# EAGLE design SensorInterface (EAGLE 9.2.1)

## Sheet 1 of 2
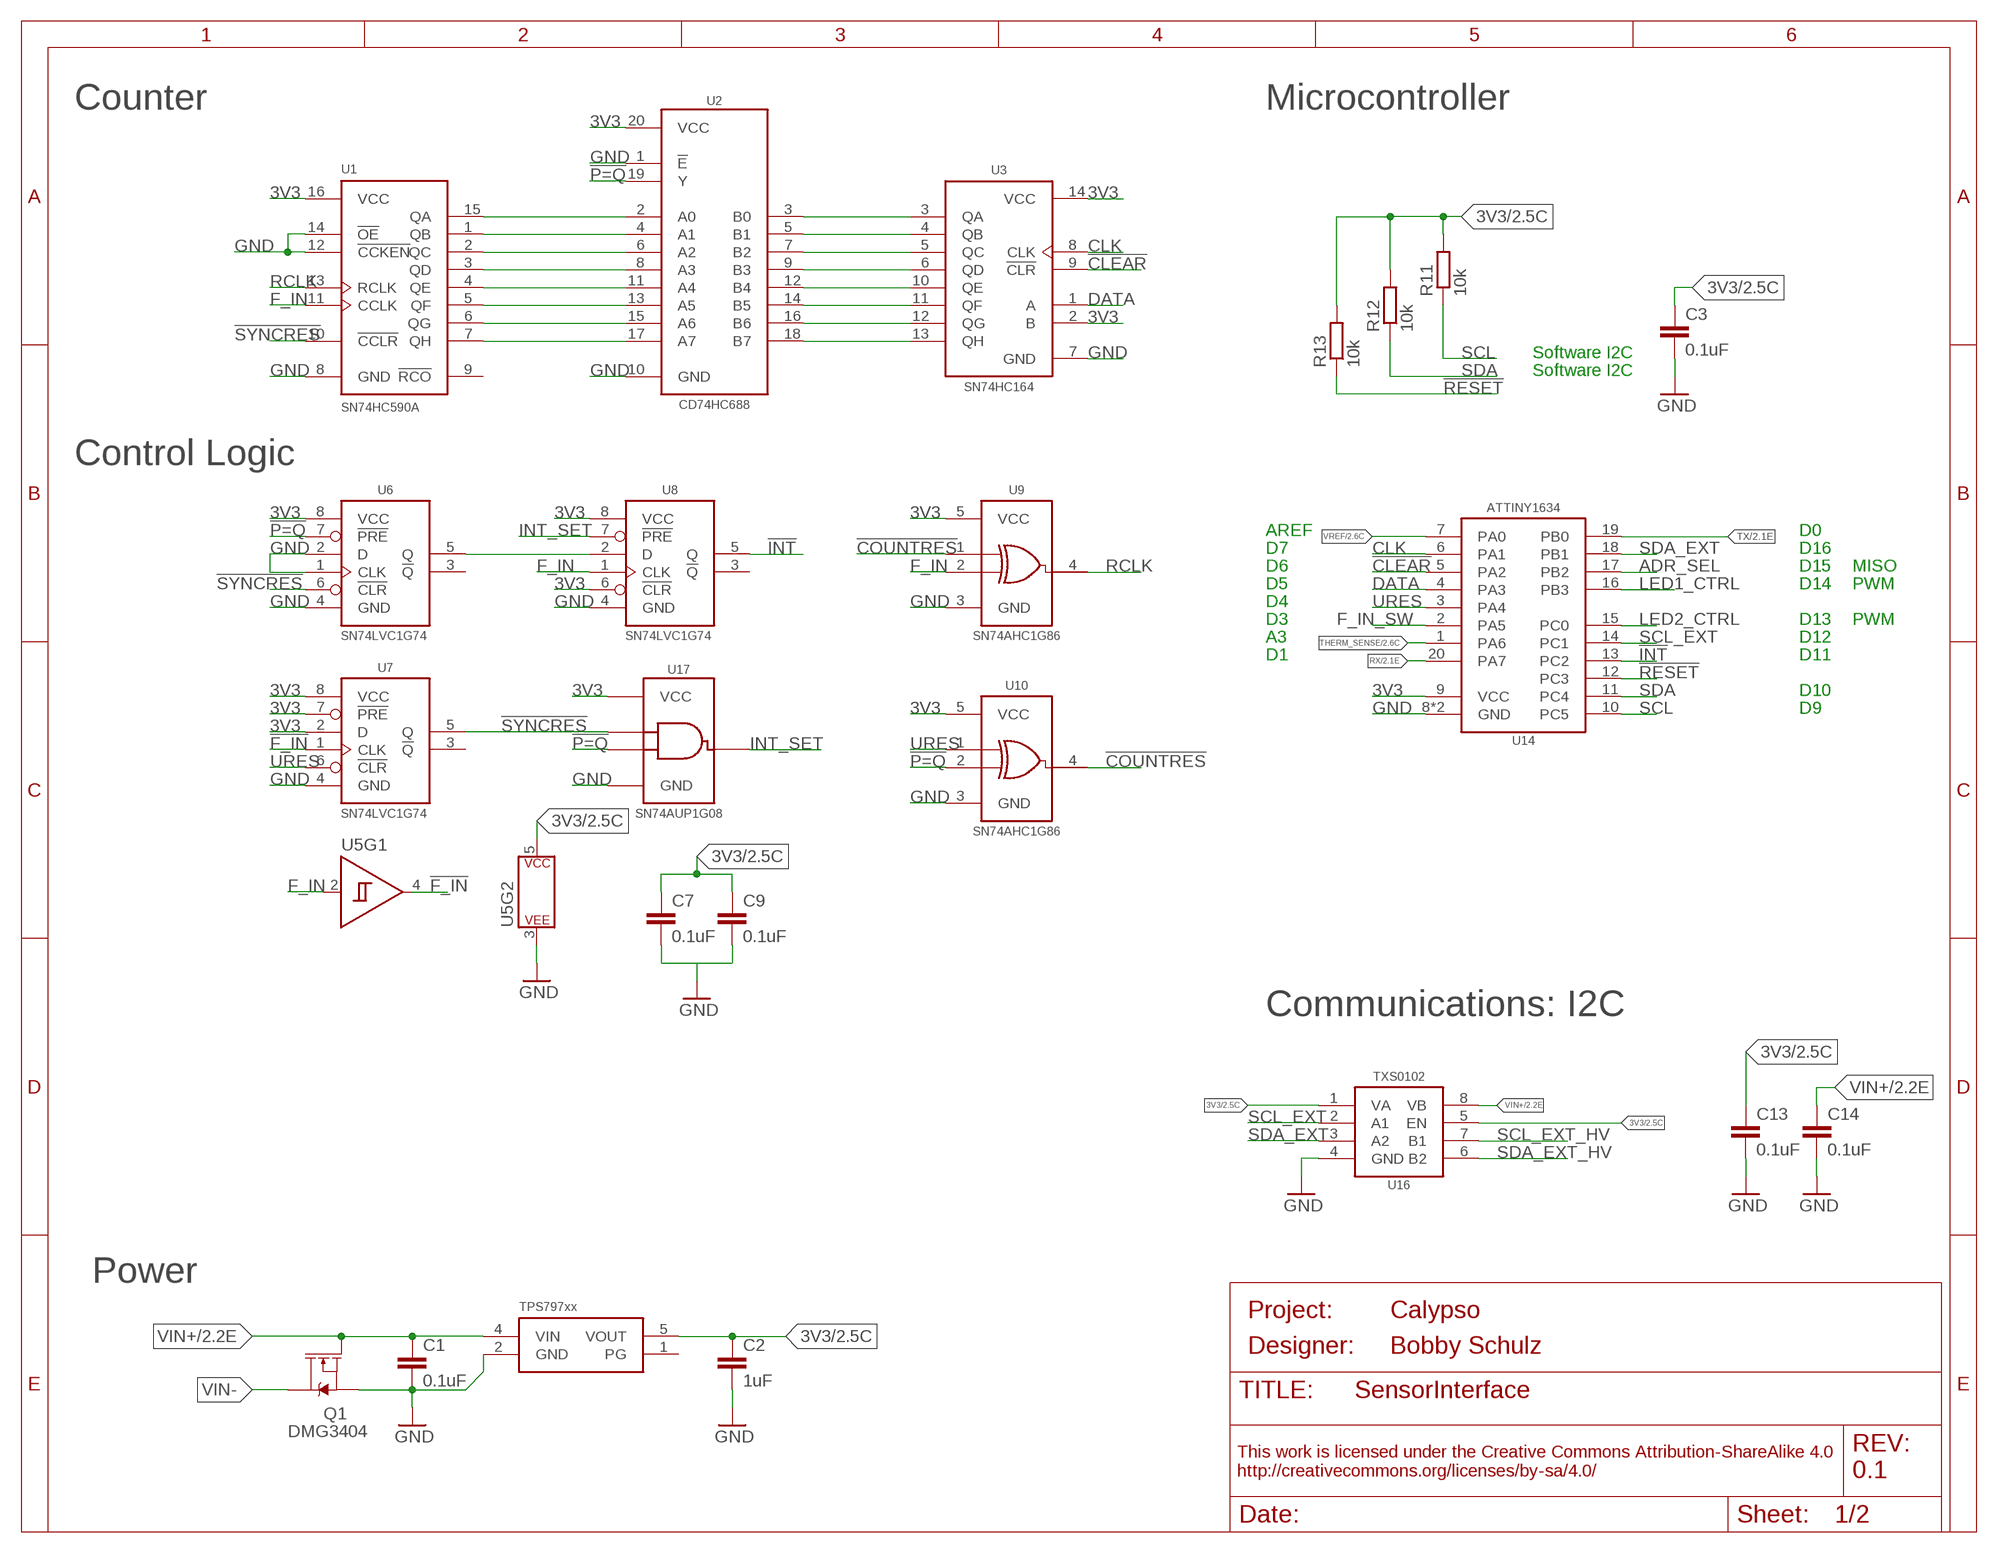
[diagram p0: schematic, sheet 1]
FRAME1 (FRAME_A_L): DESIGNER: Bobby Schulz; PROJECT: Calypso; REV: 0.1

### Parts
C1  0.1uF  C-EU0.1UFC0603  [C0603]
C2  1uF  C-EU1UFC0603  [C0603]
C3  0.1uF  C-EU0.1UFC0402  [C0402]
C7  0.1uF  C-EUC0603  [C0603]
C9  0.1uF  C-EUC0603  [C0603]
C13  0.1uF  C-EU0.1UFC0402  [C0402]
C14  0.1uF  C-EU0.1UFC0402  [C0402]
Q1  DMG3404  MOSFET-NCH-DMG3404L  [SOT23-3]
R11  10k  R-EU_10KR0402  [R0402]
R12  10k  R-EU_10KR0402  [R0402]
R13  10k  R-EU_10KR0402  [R0402]
U1  SN74HC590AD  [SO16]
U2  CD74HCT688DW  [SO-20DW]
U3  SN74HC164D  [SO14]
U5  SN74LVC1G14DCK  [DCK_R-PDSO-G5]
U6  SN74LVC1G74DCU  [DCU_(R-PDSO-G8)]
U7  SN74LVC1G74DCU  [DCU_(R-PDSO-G8)]
U8  SN74LVC1G74DCU  [DCU_(R-PDSO-G8)]
U9  SN74AHC1G86DCK  [DCK_R-PDSO-G5]
U10  SN74AHC1G86DCK  [DCK_R-PDSO-G5]
U14  ATTINY1634QFN  [QFN20]
U16  TXS0102DQM  [DQM_R-PX2SON-N8]
U17  SN74AUP1G08DCK  [DCK_R-PDSO-G5]
U$1  TPS79733  [DCK_R-PDSO-G5]

### Nets
3V3: C2.1 C3.1 C7.1 C9.1 C13.1 R11.2 R12.2 R13.2 U1.16(VCC) U2.20(VCC) U3.2(B) U3.14(VCC) U5.5(P$V+) U6.8(VCC) U7.2(D) U7.7(!PRE) U7.8(VCC) U8.6(!CLR) U8.8(VCC) U9.5(VCC) U10.5(VCC) U14.9(VCC) U16.1(VA) U16.5(EN) U17.5(VCC) U$1.5(VOUT) ; also sheet 2
!CLEAR: U3.9(!CLR) U14.5(PA2)
!COUNTRES: U9.1(A) U10.4(Y)
!F_IN: U5.4(Y) U7.1(CLK)
!INT: U8.5(Q) U14.13(PC2) ; also sheet 2
!P=Q: U2.19(Y) U6.7(!PRE) U10.2(B) U17.2(B)
!RESET: R13.1 U14.12(PC3) ; also sheet 2
!SYNCRES: U1.10(!CCLR) U6.6(!CLR) U7.5(Q) U17.1(A)
ADR_SEL: U14.17(PB2) ; also sheet 2
CLK: U3.8(CLK) U14.6(PA1)
DATA: U3.1(A) U14.4(PA3)
F_IN: U1.11(CCLK) U5.2(A) U8.1(CLK) U9.2(B) ; also sheet 2
F_IN_SW: U14.2(PA5) ; also sheet 2
GND: C1.2 C2.2 C3.2 C7.2 C9.2 C13.2 C14.2 Q1.2(S) U1.8(GND) U1.12(!CCKEN) U1.14(!OE) U2.1(!E) U2.10(GND) U3.7(GND) U5.3(P$V-) U6.1(CLK) U6.2(D) U6.4(GND) U7.4(GND) U8.4(GND) U9.3(GND) U10.3(GND) U14.8(GND) U14.EP(GND) U16.4(GND) U17.3(GND) U$1.2(GND) ; also sheet 2
INT_SET: U8.7(!PRE) U17.4(Y)
LED1_CTRL: U14.16(PB3) ; also sheet 2
LED2_CTRL: U14.15(PC0) ; also sheet 2
N$1: U1.15(QA) U2.2(A0)
N$2: U1.1(QB) U2.4(A1)
N$3: U1.2(QC) U2.6(A2)
N$4: U1.3(QD) U2.8(A3)
N$5: U1.4(QE) U2.11(A4)
N$6: U1.5(QF) U2.13(A5)
N$7: U1.6(QG) U2.15(A6)
N$8: U1.7(QH) U2.17(A7)
N$9: U2.3(B0) U3.3(QA)
N$10: U2.5(B1) U3.4(QB)
N$11: U2.7(B2) U3.5(QC)
N$12: U2.9(B3) U3.6(QD)
N$13: U2.12(B4) U3.10(QE)
N$14: U2.14(B5) U3.11(QF)
N$15: U2.16(B6) U3.12(QG)
N$16: U2.18(B7) U3.13(QH)
N$20: U6.5(Q) U8.2(D)
RCLK: U1.13(RCLK) U9.4(Y)
RX: U14.20(PA7) ; also sheet 2
SCL: R11.1 U14.10(PC5) ; also sheet 2
SCL_EXT: U14.14(PC1) U16.2(A1) ; also sheet 2
SCL_EXT_HV: U16.7(B1) ; also sheet 2
SDA: R12.1 U14.11(PC4) ; also sheet 2
SDA_EXT: U14.18(PB1) U16.3(A2) ; also sheet 2
SDA_EXT_HV: U16.6(B2) ; also sheet 2
THERM_SENSE: U14.1(PA6) ; also sheet 2
TX: U14.19(PB0) ; also sheet 2
URES: U7.6(!CLR) U10.1(A) U14.3(PA4) ; also sheet 2
VIN+: C1.1 C14.1 Q1.1(G) U16.8(VB) U$1.4(VIN) ; also sheet 2
VIN-: Q1.3(D) ; also sheet 2
VREF: U14.7(PA0) ; also sheet 2
Unconnected: U1.9(!RCO) U6.3(!Q) U7.3(!Q) U8.3(!Q) U$1.1(PG)

### Notes on the sheet
- Counter | Microcontroller
- Software I2C
- Software I2C
- Control Logic
- AREF | D0
- D7 | D16
- D6 | D15 | MISO
- D5 | D14 | PWM
- D4
- D3 | D13 | PWM
- A3 | D12
- D1 | D11
- D10
- D9
- Communications: I2C
- Power

## Sheet 2 of 2
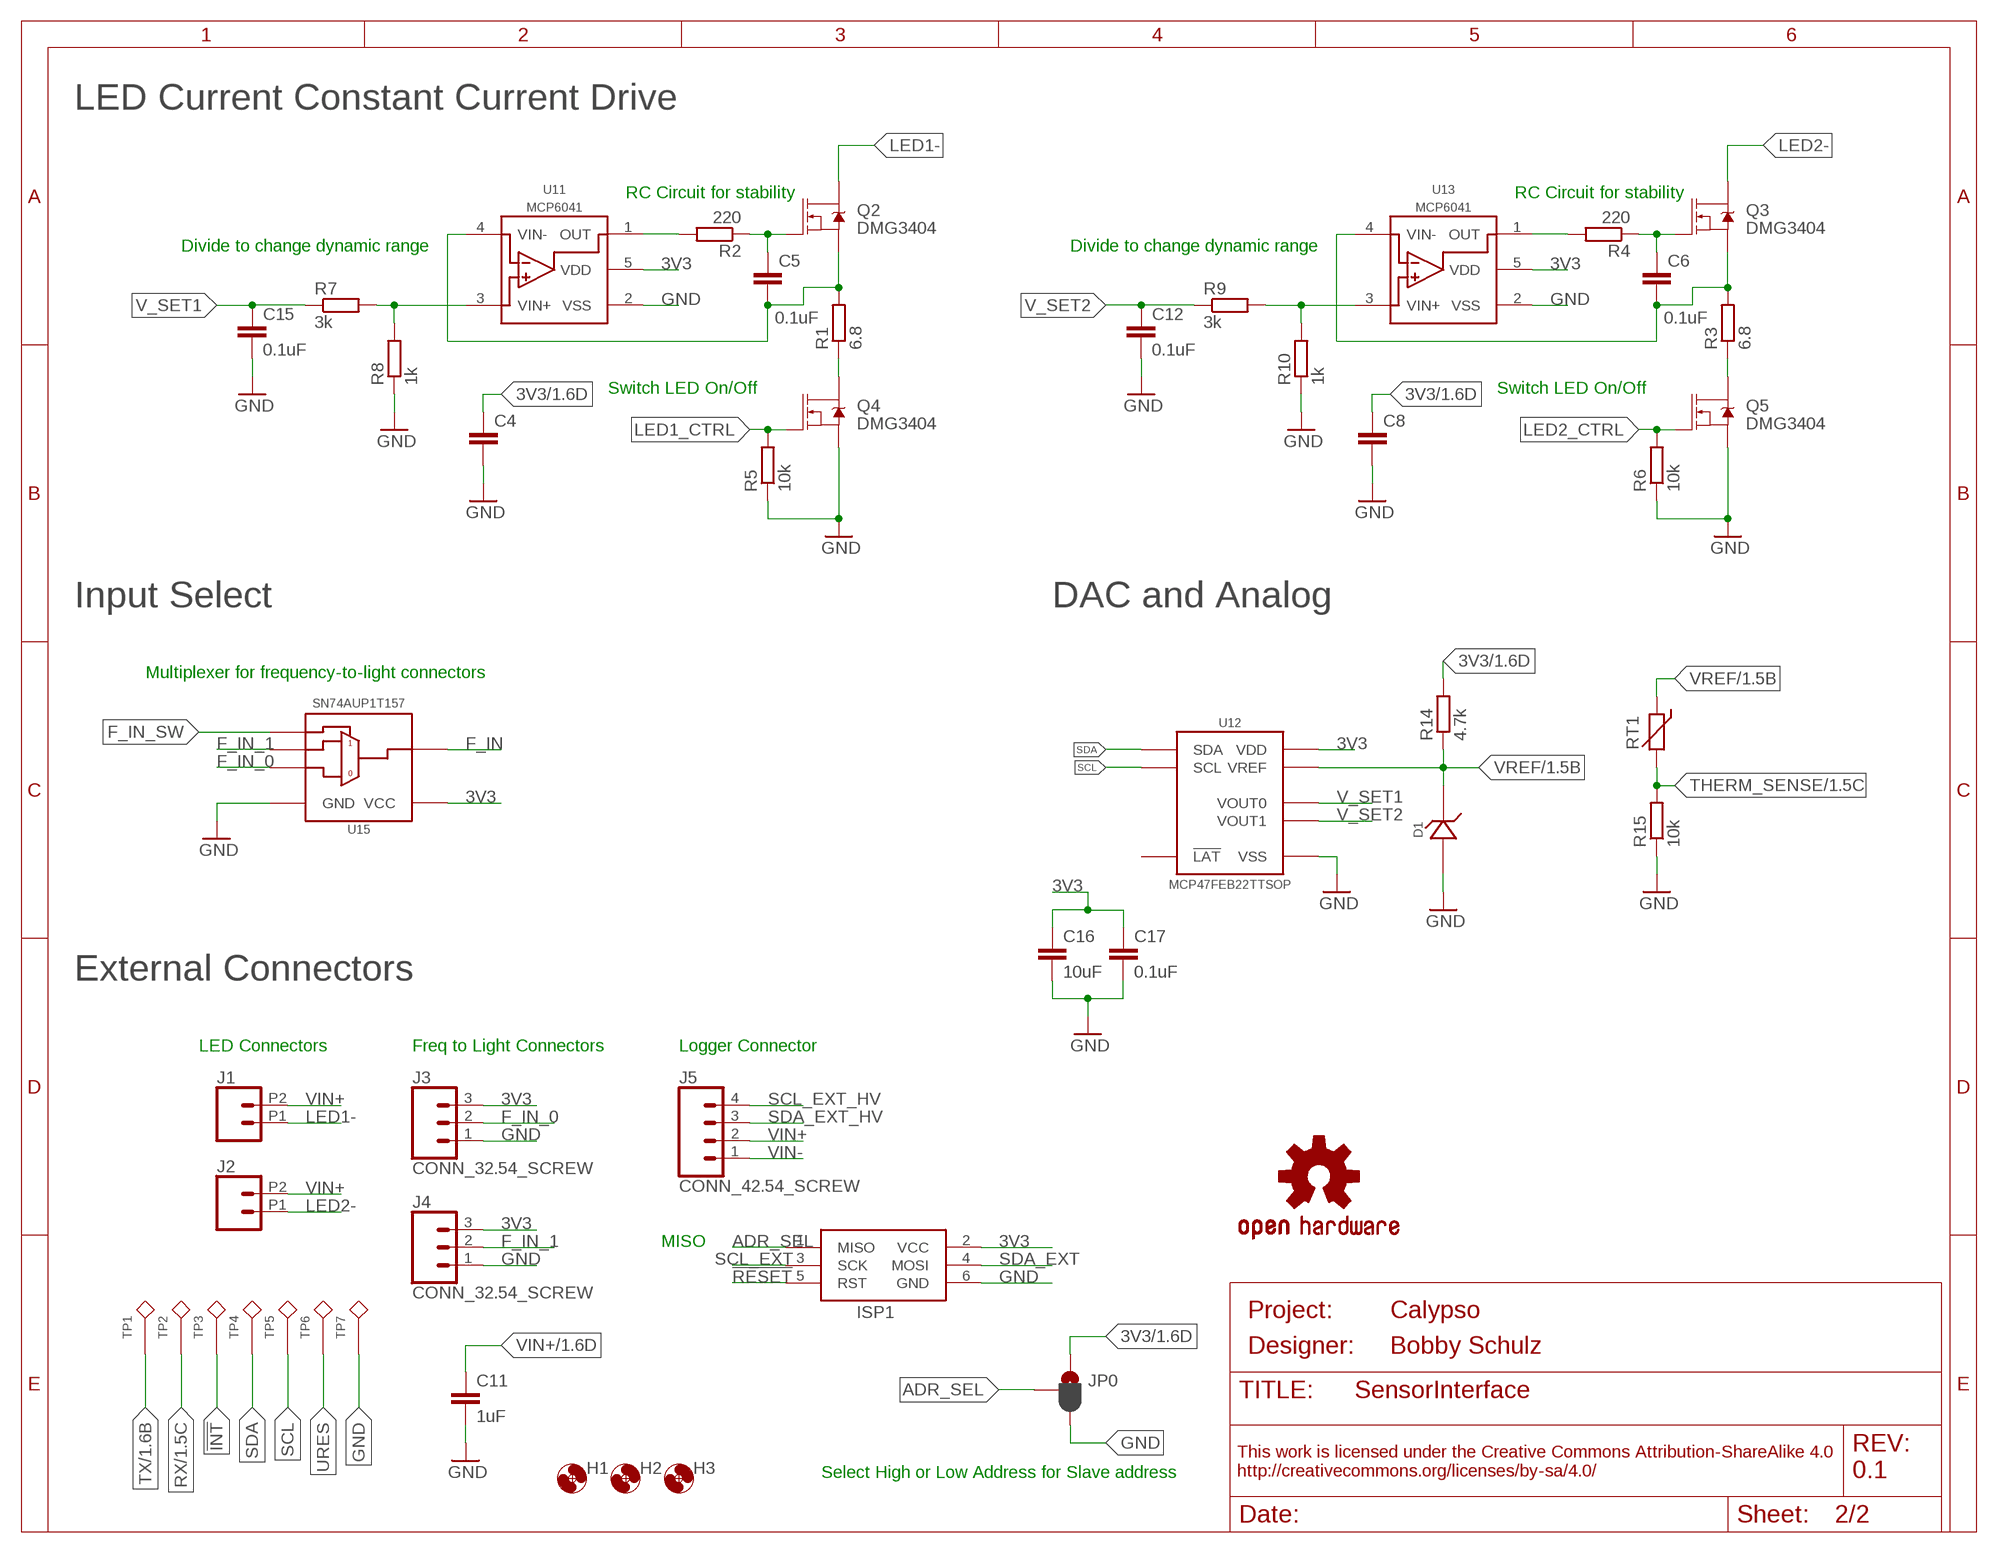
[diagram p1: schematic, sheet 2]
FRAME2 (FRAME_A_L): DESIGNER: Bobby Schulz; PROJECT: Calypso; REV: 0.1

### Parts
C4  C-EU0.1UFC0402  [C0402]
C5  0.1uF  C-EUC0603  [C0603]
C6  0.1uF  C-EUC0603  [C0603]
C8  C-EU0.1UFC0402  [C0402]
C11  1uF  C-EUC0603  [C0603]
C12  0.1uF  C-EU0.1UFC0603  [C0603]
C15  0.1uF  C-EU0.1UFC0603  [C0603]
C16  10uF  C-EUC0805  [C0805]
C17  0.1uF  C-EUC0603  [C0603]
D1  LM40402.048  [SOT23-3]
H1  MOUNTING_HOLE2_NP  [2_56]
H2  MOUNTING_HOLE2_NP  [2_56]
H3  MOUNTING_HOLE2_NP  [2_56]
ISP1  AVRISP-6  [AVRISP]
J1  CONN_02SCREW_2.54  [1X02_2.54_SCREWTERM]
J2  CONN_02SCREW_2.54  [1X02_2.54_SCREWTERM]
J3  CONN_32.54_SCREW  [1X03_SCREW]
J4  CONN_32.54_SCREW  [1X03_SCREW]
J5  CONN_42.54_SCREW  [1X04_SCREW]
JP0  JUMPER-SMT_3_1-NC_PASTE_SILK  [SMT-JUMPER_3_1-NC_PASTE_SILK]
LOGO1  OSHW-LOGOM  [OSHW-LOGO-M]
Q2  DMG3404  MOSFET-NCH-DMG3404L  [SOT23-3]
Q3  DMG3404  MOSFET-NCH-DMG3404L  [SOT23-3]
Q4  DMG3404  MOSFET-NCH-DMG3404L  [SOT23-3]
Q5  DMG3404  MOSFET-NCH-DMG3404L  [SOT23-3]
R1  6.8  R-EU_R0603  [R0603]
R2  220  R-EU_R0603  [R0603]
R3  6.8  R-EU_R0603  [R0603]
R4  220  R-EU_R0603  [R0603]
R5  10k  R-EU_R0603  [R0603]
R6  10k  R-EU_R0603  [R0603]
R7  3k  R-EU_R0603  [R0603]
R8  1k  R-EU_R0603  [R0603]
R9  3k  R-EU_R0603  [R0603]
R10  1k  R-EU_R0603  [R0603]
R14  4.7k  R-EU_R0603  [R0603]
R15  10k  R-EU_P10KR0603  [R0603]
RT1  THERMISTOR10K  [R0603]
TP1  TESTPOINTRCU  [TESTPOINT_0603]
TP2  TESTPOINTRCU  [TESTPOINT_0603]
TP3  TESTPOINTRCU  [TESTPOINT_0603]
TP4  TESTPOINTRCU  [TESTPOINT_0603]
TP5  TESTPOINTRCU  [TESTPOINT_0603]
TP6  TESTPOINTRCU  [TESTPOINT_0603]
TP7  TESTPOINTRCU  [TESTPOINT_0603]
U11  MCP6041  [SOT23-5]
U12  MCP47FEB22TTSOP  [TTSOP_8]
U13  MCP6041  [SOT23-5]
U15  SN74AUP1T157DCK  [DCK_R-PDSO-G6]

### Nets
3V3: C4.1 C8.1 C16.1 C17.1 ISP1.2(VCC) J3.3 J4.3 JP0.1 R14.2 U11.5(VDD) U12.1(VDD) U13.5(VDD) U15.5(VCC) ; also sheet 1
!INT: TP3.1 ; also sheet 1
!RESET: ISP1.5(RST) ; also sheet 1
ADR_SEL: ISP1.1(MISO) JP0.2 ; also sheet 1
F_IN: U15.6(Y) ; also sheet 1
F_IN_0: J3.2 U15.3(B)
F_IN_1: J4.2 U15.1(A)
F_IN_SW: U15.4(C) ; also sheet 1
GND: C4.2 C8.2 C11.2 C12.2 C15.2 C16.2 C17.2 D1.2(A) ISP1.6(GND) J3.1 J4.1 JP0.3 Q4.2(S) Q5.2(S) R5.1 R6.1 R8.1 R10.1 R15.1 TP7.1 U11.2(VSS) U12.5(VSS) U13.2(VSS) U15.2(GND) ; also sheet 1
LED1-: J1.P1 Q2.3(D)
LED1_CTRL: Q4.1(G) R5.2 ; also sheet 1
LED2-: J2.P1 Q3.3(D)
LED2_CTRL: Q5.1(G) R6.2 ; also sheet 1
N$18: R7.2 R8.2 U11.3(VIN+)
N$19: C6.2 Q3.2(S) R3.2 U13.4(VIN-)
N$21: C6.1 Q3.1(G) R4.1
N$22: C5.2 Q2.2(S) R1.2 U11.4(VIN-)
N$23: C5.1 Q2.1(G) R2.1
N$24: R2.2 U11.1(OUT)
N$25: R4.2 U13.1(OUT)
N$26: Q5.3(D) R3.1
N$27: Q4.3(D) R1.1
N$29: R9.2 R10.2 U13.3(VIN+)
RX: TP2.1 ; also sheet 1
SCL: TP5.1 U12.7(SCL) ; also sheet 1
SCL_EXT: ISP1.3(SCK) ; also sheet 1
SCL_EXT_HV: J5.4 ; also sheet 1
SDA: TP4.1 U12.8(SDA) ; also sheet 1
SDA_EXT: ISP1.4(MOSI) ; also sheet 1
SDA_EXT_HV: J5.3 ; also sheet 1
THERM_SENSE: R15.2 RT1.2 ; also sheet 1
TX: TP1.1 ; also sheet 1
URES: TP6.1 ; also sheet 1
V_SET1: C15.1 R7.1 U12.3(VOUT0)
V_SET2: C12.1 R9.1 U12.4(VOUT1)
VIN+: C11.1 J1.P2 J2.P2 J5.2 ; also sheet 1
VIN-: J5.1 ; also sheet 1
VREF: D1.1(C) R14.1 RT1.1 U12.2(VREF) ; also sheet 1
Unconnected: U12.6(!LAT)

### Notes on the sheet
- LED Current Constant Current Drive
- RC Circuit for stability | RC Circuit for stability
- Divide to change dynamic range | Divide to change dynamic range
- Switch LED On/Off | Switch LED On/Off
- Input Select | DAC and Analog
- Multiplexer for frequency-to-light connectors
- External Connectors
- LED Connectors | Freq to Light Connectors | Logger Connector
- MISO
- Select High or Low Address for Slave address

## Library data of the parts
C1 C12 C15 = bschulz_passives:C-EU: CAPACITOR, European symbol; DIGIKEY: 490-6051-1-ND; MF: Murata; MPN: GCM188R71E104KA57D
C2 = bschulz_passives:C-EU: CAPACITOR, European symbol; DIGIKEY: 490-10479-1-ND; MF: Murata; MPN: GRM188R61C105KA12D
C3 C4 C8 C13 C14 = bschulz_passives:C-EU: CAPACITOR, European symbol; DIGIKEY: 490-4759-1-ND; MF: Murata; MPN: GCM155R71C104KA55D
C5-C7 C9 C11 C16 C17 = bschulz_passives:C-EU: CAPACITOR, European symbol
D1 = bschulz:LM4040: LM4040 - Precision Micropower Shunt Voltage Referance Characteristics: VReverseBreakdown: 1.225V, 2.5V, 4.096V, 5.0V Output Current: 15 mA Tolerance: 1% Temp Coeficient: ±15ppm/C° Operating Temperature: -40°C to 85°C Digikey: 576-1047-1-ND (Microchip, 2.5V) <https://www.digikey.com/product-detail/en/microchip-technology/LM4040DYM3-2.5-TR/576-1047-1-ND/771818> 576-1048-1-ND (Microchip, 4.096V) <https://www.digikey.com/product-detail/en/microchip-technology/LM4040DYM3-4.1-TR/576-1048-1-ND/771819> 5LM4040CIM3-2.0/NOPBCT-ND (TI, 2.048V) <https://www.digikey.com/product-detail/en/texas-instruments/LM4040CIM3-2.0-NOPB/LM4040CIM3-2.0-NOPBCT-ND/2350623>; DIGIKEY: LM4040CIM3-2.0/NOPBCT-ND; MF: TI; MPN: LM4040CIM3-2.0/NOPB
H1-H3 = bschulz:MOUNTING_HOLE: Genaric Mechanical Mounting Hole Hole diameter based on max body diameter + 15% Keepout ring is for diameter of socket cap screw (minimum required clearance) TPlace ring is for diameter of pan head screw (recomended clearance) Specifications: Socket Cap <http://fastener-express.com/fastener-technical/SocketscapSS-Alloy.pdf> Button Head Socket Cap <http://fastener-express.com/fastener-technical/Button-Socket-alloy.pdf> Pan Head <http://fastener-express.com/fastener-technical/pan-machine-Screws.pdf>
ISP1 = bschulz:AVRISP: AVR ISP HEADER Standard 6 pin header for AVR programming
J1 J2 = bschulz:CONN_02: Multi connection point. Often used as Generic Header-pin footprint for 0.1 inch spaced/style header connections On any of the 0.1 inch spaced packages, you can populate with these: Break Away Headers - Straight <https://www.sparkfun.com/products/116> (PRT-00116) Break Away Male Headers - Right Angle <https://www.sparkfun.com/products/553> (PRT-00553) Female Headers <https://www.sparkfun.com/products/115> (PRT-00115) Break Away Headers - Machine Pin <https://www.sparkfun.com/products/117> (PRT-00117) Break Away Female Headers - Swiss Machine Pin <https://www.sparkfun.com/products/743> (PRT-00743) For SCREWTERMINALS and SPRING TERMINALS visit here: Screw Terimnals on SparkFun.com <https://www.sparkfun.com/search/results?term=Screw+Terminals> (5mm/3.5mm/2.54mm spacing) This device is also useful as a general connection point to wire up your design to another part of your project. Our various solder wires solder well into these plated through hole pads. Hook-Up Wire - Assortment (Stranded, 22 AWG) <https://www.sparkfun.com/products/11375> (PRT-11375) Hook-Up Wire - Assortment (Solid Core, 22 AWG) <https://www.sparkfun.com/products/11367> (PRT-11367) View the entire wire category on our website here <https://www.sparkfun.com/categories/141> Special notes: Molex polarized connector foot print use with: PRT-08233 with associated crimp pins and housings. 2.54_SCREWTERM for use with PRT-10571. 3.5mm Screw Terminal footprints for PRT-08084 5mm Screw Terminal footprints for use with PRT-08432; DIGIKEY: ED10561-ND; MF: OnShore; MPN: OSTVN02A150
J3 J4 = bschulz:CONN_3: Genaric 3 pin connector
J5 = bschulz:CONN_4: Genaric 4 pin connector; DIGIKEY: ED10563-ND; MF: On Shore; MPN: OSTVN04A150
JP0 = SparkFun-Jumpers:JUMPER-SMT_3_1-NC_PASTE: Normally closed solder jumper (1 of 2 connections) This jumper has an aperture in the stencil to allow solder paste to bridge one of the two connections. One connection is normally closed (NC), while the other is normally open (NO). Wick off the solder to open the connection. Reapply solder to reclose the connection. Apply solder to the other side instead to change the current path.
LOGO1 = bschulz:OSHW-LOGO: Open-Source Hardware (OSHW) Logo This logo indicates the piece of hardware it is found on incorporates a OSHW license and/or adheres to the definition of open source hardware found here: http://freedomdefined.org/OSHW
Q1-Q5 = bschulz:MOSFET-NCH: N-channel MOSFETs Voltage controlled devices that allow control of high current outputs. SparkFun Products: SparkFun OpenScale <https://www.sparkfun.com/products/13261> SparkFun Digital Sandbox <https://www.sparkfun.com/products/12651> SparkFun Monster Moto Shield <https://www.sparkfun.com/products/10182> SparkFun MOSFET Power Controller <https://www.sparkfun.com/products/11214>; DIGIKEY: DMG3404L-7DICT-ND; MF: Diodes Incorporated; MPN: DMG3404L-7
R1-R10 R14 = bschulz_passives:R-EU_: RESISTOR, European symbol Digikey Parts: Yageo, 0402 <https://www.digikey.com/products/en/resistors/chip-resistor-surface-mount/52?k=&pkeyword=&sf=0&FV=ffec1104%2Cfffc000d%2C1c0002%2C440067%2C1f140000%2Cffe00034%2C400004&quantity=&ColumnSort=0&page=1&stock=1&pageSize=25> Yageo, 0603 <https://www.digikey.com/products/en/resistors/chip-resistor-surface-mount/52?k=&pkeyword=&s=4356&s=47360&sf=0&FV=fffc000d%2C1c0002%2C142c040c%2C1f140000%2Cffe00034&quantity=10&ColumnSort=1000011&page=1&stock=1&pageSize=25> Panasonic, 0603 <https://www.digikey.com/products/en/resistors/chip-resistor-surface-mount/52?k=&pkeyword=&pv252=68&sf=0&FV=ffec373d%2C1c0002%2C142c040c%2C1f140000%2Cffe00034%2C80002%2Cc0001&quantity=&ColumnSort=0&page=1&stock=1&pageSize=25> Panasonic, precision, 0603 <https://www.digikey.com/products/en/resistors/chip-resistor-surface-mount/52?FV=ffec4907%2Cfffc000a%2Cc0172%2C142c040c%2C1f140000%2Cffe00034%2C1c0002&quantity=100&ColumnSort=2085&page=1&stock=1&pageSize=25> Panasonic, 0805 <https://www.digikey.com/products/en/resistors/chip-resistor-surface-mount/52?k=&pkeyword=&pv3=1&sf=0&FV=ffec373d%2C1c0002%2C1f140000%2Cffe00034%2C142c040d&quantity=&ColumnSort=0&page=1&stock=1&pageSize=25> Rohm, current sense <https://www.digikey.com/products/en/resistors/chip-resistor-surface-mount/52?k=&pkeyword=&pv3=1&sf=0&FV=ffecb688%2C1f140000%2Cffe00034%2C1c0002&quantity=&ColumnSort=0&page=1&stock=1&pageSize=25> Vishay, pulse proof automotive <https://www.digikey.com/products/en/resistors/chip-resistor-surface-mount/52?k=&pkeyword=&pv7=2&sf=0&FV=ffec5d6b%2Cffe00034%2C1f140000&quantity=&ColumnSort=0&page=1&stock=1&pageSize=25>; MF: Yageo
R11-R13 = bschulz_passives:R-EU_: RESISTOR, European symbol Digikey Parts: Yageo, 0402 <https://www.digikey.com/products/en/resistors/chip-resistor-surface-mount/52?k=&pkeyword=&sf=0&FV=ffec1104%2Cfffc000d%2C1c0002%2C440067%2C1f140000%2Cffe00034%2C400004&quantity=&ColumnSort=0&page=1&stock=1&pageSize=25> Yageo, 0603 <https://www.digikey.com/products/en/resistors/chip-resistor-surface-mount/52?k=&pkeyword=&s=4356&s=47360&sf=0&FV=fffc000d%2C1c0002%2C142c040c%2C1f140000%2Cffe00034&quantity=10&ColumnSort=1000011&page=1&stock=1&pageSize=25> Panasonic, 0603 <https://www.digikey.com/products/en/resistors/chip-resistor-surface-mount/52?k=&pkeyword=&pv252=68&sf=0&FV=ffec373d%2C1c0002%2C142c040c%2C1f140000%2Cffe00034%2C80002%2Cc0001&quantity=&ColumnSort=0&page=1&stock=1&pageSize=25> Panasonic, precision, 0603 <https://www.digikey.com/products/en/resistors/chip-resistor-surface-mount/52?FV=ffec4907%2Cfffc000a%2Cc0172%2C142c040c%2C1f140000%2Cffe00034%2C1c0002&quantity=100&ColumnSort=2085&page=1&stock=1&pageSize=25> Panasonic, 0805 <https://www.digikey.com/products/en/resistors/chip-resistor-surface-mount/52?k=&pkeyword=&pv3=1&sf=0&FV=ffec373d%2C1c0002%2C1f140000%2Cffe00034%2C142c040d&quantity=&ColumnSort=0&page=1&stock=1&pageSize=25> Rohm, current sense <https://www.digikey.com/products/en/resistors/chip-resistor-surface-mount/52?k=&pkeyword=&pv3=1&sf=0&FV=ffecb688%2C1f140000%2Cffe00034%2C1c0002&quantity=&ColumnSort=0&page=1&stock=1&pageSize=25> Vishay, pulse proof automotive <https://www.digikey.com/products/en/resistors/chip-resistor-surface-mount/52?k=&pkeyword=&pv7=2&sf=0&FV=ffec5d6b%2Cffe00034%2C1f140000&quantity=&ColumnSort=0&page=1&stock=1&pageSize=25>; DIGIKEY: 311-10KJRCT-ND; MF: Yageo; MPN: RC0402JR-0710KL; VALUE_PART: 10k
R15 = bschulz_passives:R-EU_: RESISTOR, European symbol Digikey Parts: Yageo, 0402 <https://www.digikey.com/products/en/resistors/chip-resistor-surface-mount/52?k=&pkeyword=&sf=0&FV=ffec1104%2Cfffc000d%2C1c0002%2C440067%2C1f140000%2Cffe00034%2C400004&quantity=&ColumnSort=0&page=1&stock=1&pageSize=25> Yageo, 0603 <https://www.digikey.com/products/en/resistors/chip-resistor-surface-mount/52?k=&pkeyword=&s=4356&s=47360&sf=0&FV=fffc000d%2C1c0002%2C142c040c%2C1f140000%2Cffe00034&quantity=10&ColumnSort=1000011&page=1&stock=1&pageSize=25> Panasonic, 0603 <https://www.digikey.com/products/en/resistors/chip-resistor-surface-mount/52?k=&pkeyword=&pv252=68&sf=0&FV=ffec373d%2C1c0002%2C142c040c%2C1f140000%2Cffe00034%2C80002%2Cc0001&quantity=&ColumnSort=0&page=1&stock=1&pageSize=25> Panasonic, precision, 0603 <https://www.digikey.com/products/en/resistors/chip-resistor-surface-mount/52?FV=ffec4907%2Cfffc000a%2Cc0172%2C142c040c%2C1f140000%2Cffe00034%2C1c0002&quantity=100&ColumnSort=2085&page=1&stock=1&pageSize=25> Panasonic, 0805 <https://www.digikey.com/products/en/resistors/chip-resistor-surface-mount/52?k=&pkeyword=&pv3=1&sf=0&FV=ffec373d%2C1c0002%2C1f140000%2Cffe00034%2C142c040d&quantity=&ColumnSort=0&page=1&stock=1&pageSize=25> Rohm, current sense <https://www.digikey.com/products/en/resistors/chip-resistor-surface-mount/52?k=&pkeyword=&pv3=1&sf=0&FV=ffecb688%2C1f140000%2Cffe00034%2C1c0002&quantity=&ColumnSort=0&page=1&stock=1&pageSize=25> Vishay, pulse proof automotive <https://www.digikey.com/products/en/resistors/chip-resistor-surface-mount/52?k=&pkeyword=&pv7=2&sf=0&FV=ffec5d6b%2Cffe00034%2C1f140000&quantity=&ColumnSort=0&page=1&stock=1&pageSize=25>; DIGIKEY: P10KDBCT-ND; MF: Panasonic; MPN: ERA-3AEB103V; VALUE_PART: 10k
RT1 = bschulz:THERMISTOR: Thermistor NTC Thermistors: Digikey = 490-12101-1-ND, R25 = 47K, Package = 0603 Digikey = 490-16279-1-ND, R25 = 10K, Package = 0603; DIGIKEY: 490-16279-1-ND; MF: Murata; MPN: NCU18XH103F60RB
TP1-TP7 = bschulz:TESTPOINT; DIGIKEY: A106145CT-ND; MF: TE Connectivity; MPN: RCU-0C
U1 = bschulz:SN74HC590A: SN74HC590A - 8 bit binary counter with direct clear Characteristics: VCC: 2~6V Operating Temperature: -40°C to 85°C fmax = 2.5 MHz (for Vcc = 2v, high for higher Vcc) Digikey: 296-8340-5-ND (SOIC) <https://www.digikey.com/product-detail/en/texas-instruments/SN74HC590AD/296-8340-5-ND/376756> 296-1599-5-ND (DIP) <https://www.digikey.com/product-detail/en/texas-instruments/SN74HC590AN/296-1599-5-ND/277245>; DIGIKEY: 296-8340-5-ND; MF: TI; MPN: SN74HC590AD
U2 = bschulz:CD74HCT688: CD74HC688 - 8 bit Magnatude Comparator Characteristics: VCC: 2~6V Operating Temperature: -55°C to 125°C Output: Active Low Digikey: 296-28201-1-ND (TSSOP) <https://www.digikey.com/product-detail/en/texas-instruments/CD74HC688PWT/296-28201-1-ND/2523385> 296-38069-1-ND (SOIC) <https://www.digikey.com/product-detail/en/texas-instruments/CD74HC688M96/296-38069-1-ND/4967274> 296-33117-5-ND (DIP) <https://www.digikey.com/product-detail/en/texas-instruments/CD74HC688E/296-33117-5-ND/1507427>
U3 = bschulz:SN74HC164: SN74HC164 - 8 bit SIPO Shift Register Characteristics: VCC: 2~6V Operating Temperature: -40°C to 125°C fmax = 6 MHz (for Vcc = 2v, high for higher Vcc) Digikey: 296-14020-1-ND (TSSOP) <https://www.digikey.com/product-detail/en/texas-instruments/SN74HC164PWR/296-14020-1-ND/522545> 296-14838-1-ND (SOIC) <https://www.digikey.com/product-detail/en/texas-instruments/SN74HC164DR/296-14838-1-ND/562706> 296-8248-5-ND (DIP) <https://www.digikey.com/products/en/integrated-circuits-ics/logic-shift-registers/712?k=sn74hc164&k=&pkeyword=sn74hc164&pv69=80&FV=ffe002c8&quantity=0&ColumnSort=0&page=1&stock=1&pageSize=25>; DIGIKEY: 296-14838-1-ND; MF: TI; MPN: SN74HC164DR
U5 = bschulz:SN74*1G14: SN74x1G14 - Single Schmitt Triger Inverter Characteristics: VCC: 0.8 ~ 3.6V (1.65 ~ 5.5V for LVC Version) Operating Temperature: -40°C to 85°C (-40°C to 125°C for LVC Version) fmax = 2.5 MHz (for Vcc =1.65v, high for higher Vcc) Output Current = ± 4 mA (± 32 mA for LVC Version) Digikey: 296-19076-1-ND (AUP Low Voltage) <https://www.digikey.com/product-detail/en/texas-instruments/SN74AUP1G14DCKR/296-19076-1-ND/864307> 296-47215-1-ND (LVC High Voltage) <https://www.digikey.com/product-detail/en/texas-instruments/SN74LVC1G14DCKR/296-11608-1-ND/385747>; DIGIKEY: 296-11608-1-ND; MF: TI; MPN: SN74LVC1G14DCKR
U6-U8 = bschulz:SN74LVC1G74: SN74LVC1G74 - D-Type Flip Flop with Clear and Preset, 1 Element Characteristics: VCC: 2 ~ 6V Edge Trigger: Positive Edge Operating Temperature: -40°C to 85°C Digikey: 296-25554-1-ND (VFSOP ) <https://www.digikey.com/product-detail/en/texas-instruments/SN74LVC1G74DCUR/296-25554-1-ND/2195379>; DIGIKEY: 296-25554-1-ND; MF: TI; MPN: SN74LVC1G74DCUR
U9 U10 = bschulz:SN74AHC1G86: SN74AHC1G86 - XOR, 1 Element, 2 Input Characteristics: VCC: 2 ~ 6V IQ = 1μA Operating Temperature: -40°C to 85°C Digikey: 296-8750-1-ND (SC-70) <https://www.digikey.com/product-detail/en/texas-instruments/SN74AHC1G86DCKR/296-8750-1-ND/373813>; DIGIKEY: 296-8750-1-ND; MF: TI; MPN: SN74AHC1G86DCKR
U11 U13 = bschulz:MCP6041: MCP6041 - Low Power Rail to Rail Op-Amp Characteristics: Vs: 1.4V ~ 6V Iq: 600nA Common Mode Range: 0V ~ 6V GBP: 14 kHz Operating Temperature: -40°C to 125°C Digikey: MCP6041T-I/OTCT-ND <https://www.digikey.com/product-detail/en/microchip-technology/MCP6041T-I-OT/MCP6041T-I-OTCT-ND/529846>; DIGIKEY: MCP6041T-I/OTCT-ND; DISP: MCP6041; MF: Microchip; MPN: MCP6041T-I/OT
U12 = bschulz:MCP47FEB*2: MCP47FEBx2 - 8/10/12 Bit, Dual Channel, Digital to Analog Converter Characteristics: VCC: 2.7~5.5V IQ: 380μA (On), 0.65μA (Shutdown) Operating Temperature: -40°C to 125°C Number of Outputs: 2 Settling Time: 6μs Number of Bits: 8 (MCP47FEB02), 10 (MCP47FEB12), 12 (MCP47FEB22) Digikey: MCP47FEB22A0-E/ST-ND (MCP47FEB22, A0) <https://www.digikey.com/product-detail/en/microchip-technology/MCP47FEB22A0-E-ST/MCP47FEB22A0-E-ST-ND/5033357>; DIGIKEY: MCP47FEB22A0-E/ST-ND; MF: Microchip; MPN: MCP47FEB22A0-E/ST
U14 = bschulz:ATTINY1634: ATtiny1634 8 bit AVR Microcontroller Features: Vcc: 1.8 ~ 5.5V Clock: Up to 16MHz, Internal 8MHz FRC, 32kHz RC Flash Memory: 16K SRAM: 1K EEPROM: 256B ADC: 10b, 12 port USART: Yes, x2 SPI: Yes I2C: Yes, slave only Notes: 2 analog comp. Digikey: ATTINY1634R-MURCT-ND (QFN) <https://www.digikey.com/product-detail/en/microchip-technology/ATTINY1634R-MUR/ATTINY1634R-MURCT-ND/3440781> ATTINY1634R-SU-ND (SOIC) <https://www.digikey.com/product-detail/en/ATTINY1634R-SU/ATTINY1634R-SU-ND/3128699/?itemSeq=272981030>; DIGIKEY: ATTINY1634-MURCT-ND; MF: Atmel; MPN: ATTINY1634-MUR
U15 = bschulz:SN74AUP1T157: SN74AUP1T157 - Non-Inverting Digital Multiplexer, Schmitt Trigger (1:2) Characteristics: VCC: 2.3~3.3V Operating Temperature: -40°C to 85°C Digikey: 296-27393-1-ND <https://www.digikey.com/product-detail/en/texas-instruments/SN74AUP1T157DCKR/296-27393-1-ND/2280367>; DIGIKEY: 296-27393-1-ND; DISP: SN74AUP1T157; MF: TI; MPN: SN74AUP1T157DCKR
U16 = bschulz:TXS0102: TXS0102 - 2 Channel Bidirectional Voltage Level Translator Characteristics: Vcc: 1.65 ~ 3.6V (Port A), 2.3 ~ 5.5V (Port B) IQ: 14.4μA Output Current: 50mA Output Type: Open Drain/Push-Pull Operating Temperature: -40°C to 85°C Digikey: 296-28368-1-ND (DQE) <https://www.digikey.com/product-detail/en/texas-instruments/TXS0102DQER/296-28368-1-ND/2625893> 296-28435-1-ND (DQM) <https://www.digikey.com/product-detail/en/texas-instruments/TXS0102DQMR/296-28435-1-ND/2638910> 296-21931-1-ND (DCU) <https://www.digikey.com/product-detail/en/texas-instruments/TXS0102DCUR/296-21931-1-ND/1629284>; DIGIKEY: 296-28435-1-ND; MF: TI; MPN: TXS0102DQMR
U17 = bschulz:SN74AUP1G08: SN74AUP1G08 - AND, 1 Element, 2 Input Characteristics: VCC: 0.8 ~ 3.6v IQ = 0.5μA Operating Temperature: -40°C to 85°C Digikey: 296-19075-1-ND (DCK) <https://www.digikey.com/product-detail/en/texas-instruments/SN74AUP1G08DCKR/296-19075-1-ND/864306> 296-18650-1-ND (DRL) <https://www.digikey.com/product-detail/en/texas-instruments/SN74AUP1G08DRLR/296-18650-1-ND/863418> 296-17366-1-ND (YZP) <https://www.digikey.com/product-detail/en/texas-instruments/SN74AUP1G08YZPR/296-17366-1-ND/691784>; DIGIKEY: 296-19075-1-ND; MF: TI; MPN: SN74AUP1G08DCKR
U$1 = bschulz:TPS797*: TPS797* - Ultra Low Power Low Dropout Linear Regulator Characteristics: Vin: 1.4V ~ 5.5V Vout: 1.8, 2.85, 3.0, 3.3V fixed IQ: 1.2μA typ, 2μA max Voltage Accuracy: 4% max Dropout Voltage: 105mV @ 10mA Output Current: 50 mA Operating Temperature: -40°C to 85°C Digikey: TPS79733 (3.3V Fixed) <https://www.digikey.com/product-detail/en/texas-instruments/TPS79733DCKR/296-11990-1-ND/390520> TPS79730 (3.0V Fixed) <https://www.digikey.com/product-detail/en/texas-instruments/TPS79730DCKR/296-11989-1-ND/390518> TPS797285 (2.85V Fixed) <https://www.digikey.com/product-detail/en/texas-instruments/TPS797285DCKR/296-25465-1-ND/2187585> TPS79718 (1.8V Fixed) <https://www.digikey.com/product-detail/en/texas-instruments/TPS79718DCKR/296-11988-1-ND/390516>; DIGIKEY: 296-11990-1-ND; MF: TI; MPN: TPS79733DCKR

## Board
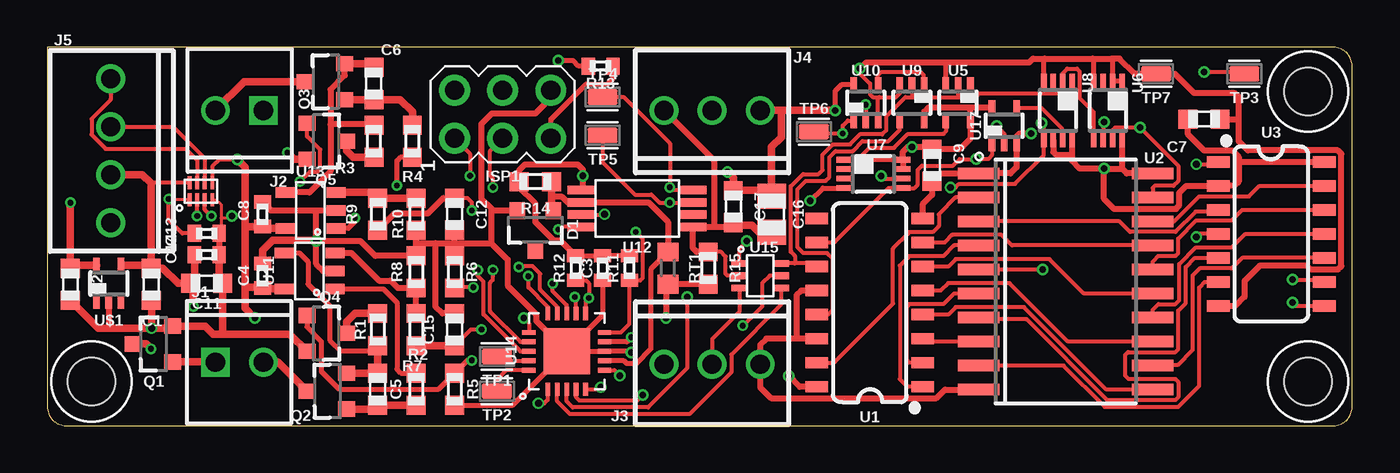
[diagram p2: board, top side]
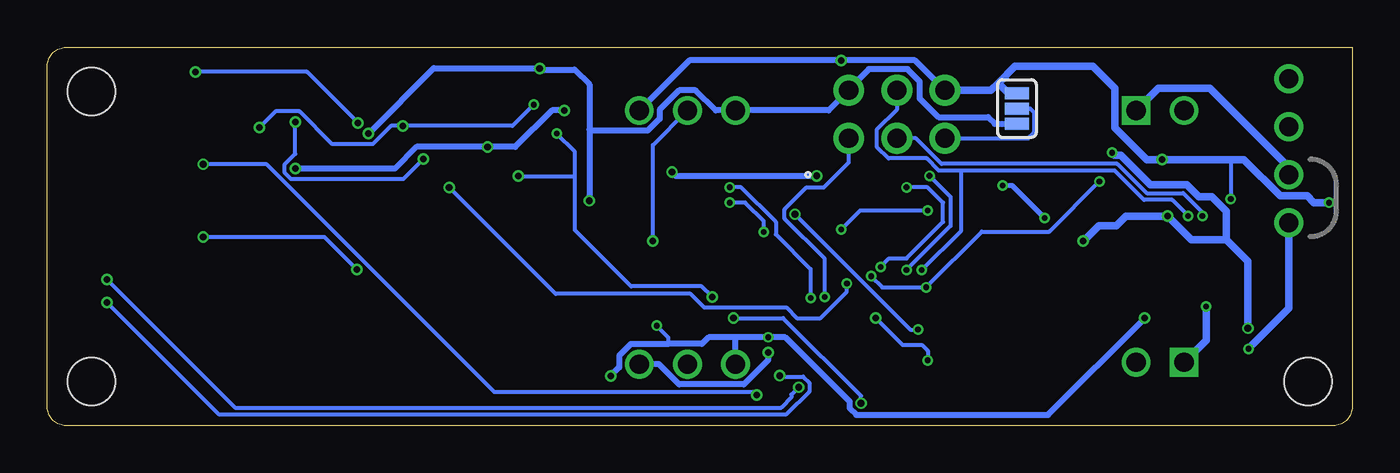
[diagram p3: board, bottom side, seen from below]

Size 69 x 20 mm. Coordinates in mm from the lower left corner, seen from the top.
Outline: 69,1 69,19 arc90 68,20 0,20 0,1 arc90 1,0 68,0 arc90 69,1
Copper layers (1*16): Top 0.035559375mm / dielectric 1.6mm / Bottom 0.035559375mm
Design rules "oshpark-2layer": minimum track width 6mil, minimum drill 10mil, track to track 6mil, track to pad 6mil, pad to pad 6mil, via to via 6mil, smd to smd 6mil, copper to edge 15mil, drill to drill 6mil, minimum pad ring 5mil, minimum via ring 5mil, stop-mask expansion 2.5mil, vias tented up to drill 0mil, thermal gap 10mil

### Footprints (pad centres in the part's own frame; a part is rotated, then mirrored left to right if it is on the bottom)
C0603 = smd 1 x 1: 1 -0.85,0; 2 0.85,0
C0402 = smd 0.7 x 0.9: 1 -0.65,0; 2 0.65,0
C0805 = smd 1.3 x 1.5: 1 -0.95,0; 2 0.95,0
SOT23-3 = smd 0.8 x 0.9: 1 -0.95,-1; 2 0.95,-1; 3 0,1.1
2_56 = hole 2.5: 0,0
AVRISP = drill 1.02 pad 1.626: 1 -1.27,2.54; 2 1.27,2.54; 3 -1.27,0; 4 1.27,0; 5 -1.27,-2.54; 6 1.27,-2.54
1X02_2.54_SCREWTERM = drill 1.016: P1 1.27,0 | drill 1.016 square: P2 -1.27,0
1X03_SCREW = drill 1.016: 1 -2.54,0; 2 0,0; 3 2.54,0
1X04_SCREW = drill 1.016: 1 -3.81,0; 2 -1.27,0; 3 1.27,0; 4 3.81,0
SMT-JUMPER_3_1-NC_PASTE_SILK = smd 0.635 x 1.27: 1 -0.813,0; 2 0,0; 3 0.813,0
R0603 = smd 1 x 1: 1 -0.85,0; 2 0.85,0
R0402 = smd 0.7 x 0.9: 1 -0.65,0; 2 0.65,0
R0603' = smd 1 x 1.1: 1 -0.85,0; 2 0.85,0
TESTPOINT_0603 = smd 1.6 x 0.8: 1 0,0
SO16 = smd 0.6 x 1.2: 1 -4.445,-2.8; 2 -3.175,-2.8; 3 -1.905,-2.8; 4 -0.635,-2.8; 5 0.635,-2.8; 6 1.905,-2.8; 7 3.175,-2.8; 8 4.445,-2.8; 9 4.445,2.8; 10 3.175,2.8; 11 1.905,2.8; 12 0.635,2.8; 13 -0.635,2.8; 14 -1.905,2.8; 15 -3.175,2.8; 16 -4.445,2.8
SO-20DW = smd 0.6 x 2.2: 1 -5.715,-4.6; 2 -4.445,-4.6; 3 -3.175,-4.6; 4 -1.905,-4.6; 5 -0.635,-4.6; 6 0.635,-4.6; 7 1.905,-4.6; 8 3.175,-4.6; 9 4.445,-4.6; 10 5.715,-4.6; 11 5.715,4.6; 12 4.445,4.6; 13 3.175,4.6; 14 1.905,4.6; 15 0.635,4.6; 16 -0.635,4.6; 17 -1.905,4.6; 18 -3.175,4.6; 19 -4.445,4.6; 20 -5.715,4.6
SO14 = smd 0.6 x 1.2: 1 -3.175,-2.8; 2 -1.905,-2.8; 3 -0.635,-2.8; 4 0.635,-2.8; 5 1.905,-2.8; 6 3.175,-2.8; 7 4.445,-2.8; 8 4.445,2.8; 9 3.175,2.8; 10 1.905,2.8; 11 0.635,2.8; 12 -0.635,2.8; 13 -1.905,2.8; 14 -3.175,2.8
DCK_R-PDSO-G5 = smd 0.35 x 0.8: 1 -0.65,-0.95; 2 0,-0.95; 3 0.65,-0.95; 4 0.65,0.95; 5 -0.65,0.95
DCU_(R-PDSO-G8) = smd 0.3 x 0.8: 1 -0.75,-1.55; 2 -0.25,-1.55; 3 0.25,-1.55; 4 0.75,-1.55; 5 0.75,1.55; 6 0.25,1.55; 7 -0.25,1.55; 8 -0.75,1.55
SOT23-5 = smd 0.55 x 1: 1 -0.95,-1.35; 2 0,-1.35; 3 0.95,-1.35; 4 0.95,1.35; 5 -0.95,1.35
TTSOP_8 = smd 1.45 x 0.45: 1 -2.95,0.975; 2 -2.95,0.325; 3 -2.95,-0.325; 4 -2.95,-0.975; 5 2.95,-0.975; 6 2.95,-0.325; 7 2.95,0.325; 8 2.95,0.975
QFN20 = smd 0.7 x 0.25: 1 -2.032,0.968; 2 -2.032,0.468; 3 -2.032,-0.032; 4 -2.032,-0.532; 5 -2.032,-1.032; 11 1.968,-1.032; 12 1.968,-0.532; 13 1.968,-0.032; 14 1.968,0.468; 15 1.968,0.968 | smd 0.25 x 0.7: 6 -1.032,-2.032; 7 -0.532,-2.032; 8 -0.032,-2.032; 9 0.468,-2.032; 10 0.968,-2.032; 16 0.968,1.968; 17 0.468,1.968; 18 -0.032,1.968; 19 -0.532,1.968; 20 -1.032,1.968 | smd 2.45 x 2.45: EP -0.032,-0.032
DCK_R-PDSO-G6 = smd 0.35 x 0.85: 1 -0.65,-1.1; 2 0,-1.1; 3 0.65,-1.1; 4 0.65,1.1; 5 0,1.1; 6 -0.65,1.1
DQM_R-PX2SON-N8 = smd 0.2 x 0.7: 1 -0.6,-0.45; 2 -0.2,-0.45; 3 0.2,-0.45; 4 0.6,-0.45; 5 0.6,0.45; 6 0.2,0.45; 7 -0.2,0.45; 8 -0.6,0.45

### Placement (x,y rotation side)
C1  5.49,7.47 270 top
C2  1.22,7.47 270 top
C3  29.36,8.33 270 top
C4  11.38,7.92 90 top
C5  17.48,1.93 90 top
C6  17.27,18.08 90 top
C7  61.16,16.21 0 top
C8  11.38,11.18 90 top
C9  46.79,13.77 270 top
C11  8.43,7.52 0 top
C12  21.54,11.18 270 top
C13  8.43,10.16 0 top
C14  8.43,9.04 0 top
C15  21.54,5.08 90 top
C16  38.3,11.18 270 top
C17  36.27,11.58 270 top
D1  25.81,10.36 180 top
H1  2.34,2.34 0 top
H2  66.66,17.66 0 top
H3  66.66,2.34 0 top
ISP1  24.08,16.46 90 top
J1  10.16,3.35 0 top
J2  10.16,16.66 180 top
J3  35.15,3.25 180 top
J4  35.15,16.66 0 top
J5  3.35,14.53 90 top
JP0  17.73,16.76 270 bottom
LOGO1  41.35,9.65 0 bottom
Q1  5.64,4.32 90 top
Q2  14.83,1.83 90 top
Q3  14.73,18.19 90 top
Q4  14.73,4.88 270 top
Q5  14.73,15.04 270 top
R1  17.48,5.08 270 top
R2  19.51,1.93 90 top
R3  17.27,15.04 90 top
R4  19.3,15.04 270 top
R5  21.54,1.93 90 top
R6  21.54,8.13 270 top
R7  19.51,5.08 90 top
R8  19.51,8.13 270 top
R9  17.48,11.18 90 top
R10  19.51,11.18 90 top
R11  30.78,8.33 90 top
R12  27.94,8.33 90 top
R13  29.26,19 180 top
R14  25.81,12.9 180 top
R15  34.95,8.33 270 top
RT1  [R0603']  32.82,8.33 270 top
TP1  23.77,3.66 180 top
TP2  23.77,1.83 180 top
TP3  63.3,18.59 180 top
TP4  29.36,17.37 0 top
TP5  29.36,15.34 180 top
TP6  40.54,15.54 0 top
TP7  58.62,18.59 180 top
U1  43.48,6.5 90 top
U2  53.85,7.62 270 top
U3  64.72,10.77 270 top
U5  48.16,17.07 180 top
U6  56.08,16.66 180 top
U7  43.69,13.31 270 top
U8  53.44,16.66 180 top
U9  45.72,17.07 180 top
U10  43.28,17.07 0 top
U11  13.87,8.18 90 top
U12  31.19,11.48 0 top
U13  13.92,11.38 90 top
U14  27.43,3.96 90 top
U15  37.69,7.92 270 top
U16  8.13,12.4 0 top
U17  50.6,15.85 0 top
U$1  3.25,7.52 0 top

### Tracks (layer width: path | path; a pad name or v marks a point on that pad's centre or on a via)
3V3  (via drill 0.3, 0.35)
  Top 0.152: U16.1 6.47,11.95 v6.42,11.99 | v10.06,14.06 10.06,13.96
  Top 0.2: 7.53,10.41 C13.1 7.13,10.16 6.42,10.87 v6.42,11.99 | U15.5 38.2,7.92 37.8,7.52 37.8,6.3 v36.78,5.28 | v10.06,14.06 9.09,14.06 8.73,13.71 U16.5
  Top 0.254: U7.8 43.52,14.06 43.02,13.56 U7.2 | R12.2 C3.1 R11.2 | v27.03,19.3 27.8,19.3 28.1,19 R13.2 | v30.89,4.67 30.66,4.44 30.65,4.44 30.63,4.43 U14.9 | U10.5 42,18.02 41.66,17.68 v41.66,16.66
  Top 0.305: U9.5 46.37,16.6 46.6,16.82 48.77,16.82 | U1.16 39.78,2.06 v39.21,2.63 | R14.2 24.92,12.94 24.92,12.58 | U12.1 28.31,12.52 v28.31,13.21 28.31,13.55 28.04,13.82 25.26,13.82 24.96,13.51 R14.2 | U7.7 U7.8 45.24,14.47 45.5,14.73 v45.72,14.73 46.67,14.73 C9.1 48.25,14.62 48.81,15.18 U5.5 48.81,16.78 48.77,16.82 | R12.2 27.14,9.78 26.79,9.78 25.81,10.76 25.81,11.75 24.96,12.6 R14.2 | v55.88,13.59 54.58,13.59 54.19,13.98 54.19,14.33 | 54.19,14.33 U8.8 | U8.6 53.19,14.47 53.34,14.33 54.19,14.33 | v55.88,13.59 55.88,11.99 56.41,11.46 59.67,11.46 59.85,11.64 59.85,12.3 60.22,12.68 U3.2 | U2.20 57.07,13.34 56.83,13.58 | 56.83,13.58 U6.8 | v55.88,13.59 56.82,13.59 56.83,13.58 | U17.5 49.92,16.82 48.77,16.82 | C7.1 60.31,15.39 61.16,14.55 62.65,14.55 62.99,14.2 62.99,13.92 | U3.2 61.98,12.68 | 62.99,13.92 62.99,12.9 62.76,12.68 U3.2 | U3.14 67.49,13.92 62.99,13.92
  Top 0.406: U$1.5 1.37,8.47 C2.1 v1.22,11.79 | v35.97,13.41 36.27,13.11 C17.1 38,12.43 C16.1 38.3,14.73 38.81,15.24 38.81,16.66 | v10.06,14.06 10.46,13.66 10.46,10.57 | v10.97,5.69 10.46,6.2 10.46,7.32 | 10.46,10.57 10.46,7.32 | U11.5 11.43,7.23 C4.1 11.34,7.32 10.46,7.32 | U13.5 11.48,10.43 C8.1 10.51,10.53 10.46,10.57 | J4.3 38.81,16.66 | 38.81,16.66 v41.66,16.66
  Bottom 0.2: v36.78,5.28 36.17,4.67 36.17,4.32 | 6.5,14.06 6.42,13.98 v6.42,11.99
  Bottom 0.305: ISP1.2 23.11,19.3 v27.03,19.3 35.05,19.3 J4.3 | v39.21,2.63 38.76,3.08 38.76,3.69 38.13,4.32 36.17,4.32 34.39,4.32 34.04,4.67 32.61,4.67 | 17.54,17.39 JP0.1 | v55.88,13.59 50.62,13.59 49.48,14.73 v45.72,14.73 44.25,14.73 42.32,16.66 v41.66,16.66 | v35.97,13.41 35.76,13.21 v28.31,13.21 | v10.97,5.69 16.09,0.58 26.23,0.58 26.58,0.93 26.58,1.28 29.97,4.67 v30.89,4.67 32.61,4.67 | J3.3 32.61,4.67
  Bottom 0.406: ISP1.2 19.1,17.73 18.72,18.11 | 18.72,18.11 17.83,19 13.72,19 12.55,17.83 12.55,15.75 10.86,14.06 v10.06,14.06 6.5,14.06 5.74,14.06 3.82,12.14 2.39,12.14 2.03,11.79 v1.22,11.79 | JP0.1 18.19,17.58 18.72,18.11
!CLEAR  (via drill 0.35)
  Top 0.203: U14.5 29.16,1.93 v29.26,2.03 | v65.84,7.72 67.39,7.72 U3.9
  Bottom 0.203: v29.26,2.03 29.65,1.64 29.65,1.49 30.18,0.96 59.08,0.96 v65.84,7.72
!COUNTRES
  Top 0.203: U10.4 43.93,18.53 44.08,18.67 46.2,18.67 46.35,18.52 46.35,18.14 46.37,18.12 U9.1
!F_IN
  Top 0.203: U7.1 42.85,14.06 43.47,14.68 44.77,14.68 45.52,15.42 47.39,15.42 47.51,15.54 U5.4
!INT  (via drill 0.3, 0.35)
  Top 0.203: U14.13 27.46,6.37 26.72,7.11 v26.72,7.52 | v47.75,12.6 48.02,12.6 48.2,12.78 51.17,12.78 52.69,14.3 U8.5 52.69,15.88 v52.58,16 | v61.16,18.69 63.2,18.69 TP3.1
  Bottom 0.2: 34.27,6.25 29.92,6.25 29.36,5.69 28.12,5.69 26.72,7.08
  Bottom 0.203: 26.72,7.08 v26.72,7.52 | v47.75,12.6 42.12,6.96 34.98,6.96 34.27,6.25 | v52.58,16 55.27,18.69 v61.16,18.69
!P=Q  (via drill 0.3, 0.35)
  Top 0.203: v43.28,16.97 U10.2 | v50.19,15.85 50.6,15.44 U17.2 | U6.7 56.33,15.62 56.48,15.77 v57.78,15.77 59.8,13.74 59.8,12.93 59.55,12.68 58.55,12.68 58.45,12.57 U2.19
  Bottom 0.203: v43.28,16.97 44.4,15.85 v50.19,15.85 50.83,15.85 51.79,14.89 53.94,14.89 55.66,16.61 56.93,16.61 v57.78,15.77
!RESET  (via drill 0.3)
  Top 0.203: U14.12 27.96,6.73 v27.89,6.81
  Top 0.254: ISP1.5 26.62,16.18 28.49,18.05 29.64,18.05 29.91,18.33 R13.1
  Bottom 0.2: 30.02,10.95 30.02,11.43 28.85,12.6 27.94,12.6 26.62,13.92 ISP1.5
  Bottom 0.203: v27.89,6.81 27.89,8.81 30.02,10.95
!SYNCRES  (via drill 0.35)
  Top 0.203: U1.10 41.6,9.68 44.48,12.56 U7.5 45.85,12.56 46.03,12.74 46.03,13.52 46.25,13.74 47.9,13.74 48.24,14.09 v49.12,14.09 49.75,14.09 49.95,14.29 U17.1 | v55.89,16.05 55.83,16 U6.6
  Bottom 0.203: v55.89,16.05 55.89,14.37 56.44,13.82 56.44,13.36 56.11,13.04 50.17,13.04 v49.12,14.09
ADR_SEL  (via drill 0.3)
  Top 0.2: 23.42,6.03 23.42,7.57 23.57,7.72 v23.57,8.23 | ISP1.1 22.35,14.38 v22.35,13.21
  Top 0.203: U14.17 25.02,4.43 23.42,6.03
  Bottom 0.2: v22.35,13.21 21.23,12.09 21.23,10.57 v23.57,8.23 | JP0.2 17.03,16.76 16.84,16.58
  Bottom 0.203: ISP1.1 17.15,15.19 16.84,15.49 16.84,16.58
CLK  (via drill 0.35)
  Top 0.203: U14.6 29.99,2.93 v30.28,2.64 | U3.8 66.02,6.33 v65.84,6.5
  Bottom 0.203: v30.28,2.64 30.22,2.59 29.03,2.59 28.7,2.26 28.7,1.8 29.9,0.6 59.94,0.6 v65.84,6.5
DATA  (via drill 0.35)
  Top 0.2: v31.5,1.63 31.2,1.32 28.14,1.32 27.96,1.5 U14.4
  Top 0.203: v60.76,13.82 61.79,13.82 U3.1
  Bottom 0.203: v31.5,1.63 31.65,1.78 45.35,1.78 57.4,13.82 v60.76,13.82
F_IN
  Top 0.2: U1.11 40.52,8.57 39.52,8.57 | 39.52,8.57 U15.6 | 39.32,9.28 39.32,9.18 39.52,8.98 39.52,8.57
  Top 0.203: 41.53,14.87 41.54,14.87 | 45.72,17.36 45.38,17.36 44.36,16.34 44.36,15.61 44.14,15.39 42.97,15.39 42.45,14.87 41.55,14.87 41.54,14.87 | 45.72,17.36 48.16,17.36 | 48.16,17.36 49.09,17.36 49.28,17.56 53.95,17.56 54.19,17.8 U8.1 | U5.2 48.16,17.36 | U9.2 45.72,17.36 | 39.32,9.28 39.32,12.66 39.33,12.66 39.96,13.3 40.78,13.3 41,13.51 41,14.33 41.54,14.87
F_IN_0
  Top 0.2: U15.3 36.59,6.01 35.15,4.57 J3.2
F_IN_1  (via drill 0.35)
  Top 0.2: U15.1 36.59,9.37 v36.98,9.75
  Bottom 0.203: v36.98,9.75 36.98,14.83 J4.2
F_IN_SW
  Top 0.2: U15.4 38.79,6.38 36.17,3.76 36.17,2.83 33.95,0.61 27.64,0.61 26.96,1.28 U14.2
GND  (via drill 0.3, 0.35)
  Top 0.152: U16.4 8.93,11.95 9.18,11.69 9.18,10.97 | v9.75,11.07 9.65,10.97 9.18,10.97 | 9.18,10.97 9.18,10.26 C13.2
  Top 0.2: 34.95,8.94 R15.1 35.62,9.18 35.87,8.94 35.87,8.03 35.97,7.92 U15.2 | 44.01,16.19 U10.3 43.93,17.3 43.99,17.37 | v42.97,18.87 42.97,18.61 43.5,18.08 43.5,17.51 43.65,17.37 43.99,17.37 | 43.99,17.37 44.88,17.37 45.07,17.55 U9.3
  Top 0.254: v40.34,11.89 41.01,12.56 U7.4 | R5.1 24.61,1.08 U14.EP | U8.4 52.69,19.37 52.73,19.41 | U6.4 55.33,19.34 55.27,19.41 | U6.1 U6.2 56.33,19.36 56.29,19.41 | C3.2 29.36,5.83 U14.EP | U10.3 43.98,16.17 | U5.3 47.51,19.16 47.55,19.2 | v30.89,3.86 30.82,3.93 U14.8 U14.EP
  Top 0.305: U1.8 46.28,11.7 46.79,12.21 C9.2 47.2,13.34 U2.1 50.93,13.34 51.25,13.65 U17.3 51.25,15.28 51.41,15.44 v52.02,15.44 | U10.3 43.95,16.14 | U1.14 39.62,4.6 | 39.62,4.6 38.02,4.6 37.69,4.27 J3.1 37.69,2.03 38.27,1.45 47.01,1.45 47.46,1.91 U2.10 | 40.32,7.14 U1.12 39.85,7.14 39.62,6.91 39.62,4.6 | 45.07,17.96 U9.3 | 34.03,10.51 U12.5 | 27.46,3.89 U14.EP 25.87,5.52 25.87,5.87 24.35,7.4 24.35,8.77 23.47,9.65 | ISP1.6 26.62,17.32 25.81,16.51 23.52,16.51 22.95,15.94 22.95,12.01 23.47,11.48 | U11.2 14.58,8.18 14.22,8.53 v14.22,9.75 | 19.51,9.75 R8.1 17.34,8.98 16.56,9.75 v14.22,9.75 | 19.51,9.75 R10.1 | R6.1 21.54,9.65 | 21.54,9.65 C12.2 | 19.51,9.75 19.61,9.65 20.52,9.65 | 20.52,9.65 21.54,9.65 | C15.2 20.89,5.93 20.52,6.3 20.52,9.65 | 21.54,9.65 23.47,9.65 | U12.5 35.26,10.51 | 35.26,10.51 36.05,10.51 36.14,10.6 C17.2 | 35.26,9.49 R15.1 34.34,9.18 34.14,9.38 U12.5 | 35.26,10.51 35.26,14.02 J4.1 | C13.2 C14.2 | C8.2 11.83,11.38 14.22,11.38 | 14.22,11.38 U13.2 | v14.22,9.75 14.22,11.38 | 23.47,11.48 23.47,9.65 | D1.2 23.59,11.36 23.47,11.48 | U$1.2 3.25,5.15 | v42.97,18.87 43.3,19.2 47.55,19.2 51.92,19.2 52.12,19.41 52.73,19.41 55.27,19.41 56.29,19.41 56.69,19.41 57.51,18.59 TP7.1 59.63,18.59 60.64,17.58 62.79,17.58 62.99,17.37 62.99,16.15 | U3.7 62.81,6.33 63.3,6.81 63.3,7.64 64.11,8.46 66.59,8.46 66.79,8.26 68.25,8.26 68.42,8.44 68.42,14.37 68.25,14.55 63.48,14.55 62.99,15.04 62.99,16.15 | C7.2 62.94,16.2 62.99,16.15
  Top 0.406: Q5.2 13.04,14.09 v12.7,14.43 | C4.2 11.38,9.27 11.91,9.8 14.18,9.8 v14.22,9.75 | C14.2 9.08,7.72 C11.2 9.28,4.88 9.25,4.84 | Q4.2 12.81,4.84 9.25,4.84 | C1.2 5.52,6.58 v5.52,5.15 | C2.2 2.69,5.15 3.25,5.15 v5.52,5.15 | v5.52,5.15 6.52,5.15 Q1.2 8.35,5.27 8.77,4.84 9.25,4.84 | C16.2 37.63,10.23 37.26,10.6 36.14,10.6
  Bottom 0.305: v30.89,3.86 30.89,3.47 32.17,2.18 35.59,2.18 36.66,3.25 J3.1 | v52.02,15.44 48.56,18.9 42.99,18.9 v42.97,18.87 42.92,18.82 | JP0.3 18.9,15.95 19.25,16.31 21.88,16.31 22.86,17.29 22.86,18.19 23.52,18.85 25.56,18.85 26.62,17.79 ISP1.6 27.69,16.66 J4.1 33.65,16.66 34.71,17.73 35.59,17.73 36.63,16.7 36.63,16.22 37.25,15.6 40.28,15.6 40.34,15.65 | 42.97,18.82 42.92,18.82 | 42.92,18.82 41.13,18.82 40.34,18.03 40.34,15.65 | 40.34,15.65 v40.34,11.89
  Bottom 0.406: 6.67,9.83 8.51,9.83 v9.75,11.07 11.96,11.07 12.46,10.58 13.4,10.58 v14.22,9.75 | v5.52,5.15 5.52,8.68 6.67,9.83 | v12.7,14.43 12.57,14.3 12.23,14.3 10.67,12.74 8.75,12.74 8.1,12.09 7.42,12.09 7.05,11.73 6.68,11.36 6.67,11.34 6.67,9.83
INT_SET
  Top 0.203: U8.7 53.64,15.16 53.64,15.72 52.56,16.8 U17.4
LED1-
  Top 0.406: Q2.3 12.21,3.35 J1.P1
LED1_CTRL  (via drill 0.3, 0.35)
  Top 0.203: v25.2,5.69 25.46,5.42 U14.16
  Top 0.254: v22.45,3.45 22.21,3.45 R5.2 20.69,1.93 15.44,1.93 14.49,2.87 14.49,4.46 13.73,5.22 Q4.1
  Bottom 0.203: v25.2,5.69 23.77,4.27 22.76,4.27 22.45,3.96 v22.45,3.45
LED2-
  Top 0.406: Q3.3 10.41,18.19 J2.P1
LED2_CTRL  (via drill 0.3)
  Top 0.2: U14.15 26.46,6.29 25.44,7.31 v25.44,7.9 | v22.54,7.32 21.58,7.32 R6.2 | Q5.1 13.73,15.29 14.43,14.59 14.43,13.58 14.29,13.43 13.89,13.43 v13.37,12.91
  Bottom 0.2: v25.44,7.9 24.85,7.32 v22.54,7.32 19.59,10.26 16.02,10.26 v13.37,12.91
N$1
  Top 0.2: U2.2 48.03,12.06 47.14,11.17 47.14,10.54 46.83,10.23 45.58,10.23
  Top 0.203: U1.15 41.6,3.33 44.72,6.45 44.72,9.37 45.58,10.23
N$2
  Top 0.203: U2.4 47.95,9.53 47.39,8.96 45.58,8.96 45.08,8.46 45.08,2.46 45.48,2.06 U1.1
N$3
  Top 0.203: U2.6 47.95,6.99 47.39,6.42 45.58,6.42 45.43,6.27 45.43,3.48 45.58,3.33 U1.2
N$4
  Top 0.203: U1.3 46.44,4.45 U2.8
N$5
  Top 0.203: U1.4 47.64,5.87 48.04,6.27 51.64,6.27 56.01,1.91 U2.11
N$6
  Top 0.203: U1.5 47.23,7.14 47.64,7.54 50.88,7.54 53.98,4.45 U2.13
N$7
  Top 0.203: U2.15 54.82,6.99 52.99,8.81 48.04,8.81 47.64,8.41 U1.6
N$8
  Top 0.203: U1.7 47.44,9.68 47.84,10.08 50.45,10.08 51.01,9.53 U2.17
N$9
  Top 0.203: U3.3 61.82,11.31 60.72,11.31 59.65,10.24 57.24,10.24 56.69,10.79 U2.3
N$10  (via drill 0.35)
  Top 0.203: U3.4 60.92,10.13 v60.76,9.97 | v52.63,8.25 U2.5
  Bottom 0.203: v60.76,9.97 54.35,9.97 v52.63,8.25
N$11
  Top 0.2: 59.65,2.46 57.18,2.46 57,2.64 57,3.75 57.14,3.89
  Top 0.203: U2.7 49.35,5.61 51.8,5.61 56.06,1.35 59.65,1.35 59.8,1.5 59.8,2.31 59.65,2.46 | U3.5 60.68,8.87 60.2,8.39 60.2,6.48 59.8,6.08 59.8,4.04 59.65,3.89 57.14,3.89
N$12
  Top 0.203: U2.9 53.73,3.17 55.91,0.99 59.8,0.99 60.91,2.11 60.91,7.3 61.21,7.59 U3.6
N$13
  Top 0.203: U2.12 58.5,3.23 59.8,3.23 60.56,3.99 60.56,7.93 60.94,8.31 62.62,8.31 63.18,8.87 U3.10
N$14
  Top 0.203: U2.14 58.45,6.12 58.76,6.43 59.65,6.43 59.85,6.62 59.85,8.53 60.73,9.42 62.64,9.42 63.36,10.13 U3.11
N$15
  Top 0.203: U2.16 58.45,8.66 58.76,8.97 59.65,8.97 59.8,9.12 59.8,9.89 60.77,10.85 62.62,10.85 63.18,11.4 U3.12
N$16
  Top 0.203: U2.18 59.58,10.79 60.91,12.12 63.54,12.12 64.09,12.68 U3.13
N$18
  Top 0.203: R7.2 19.13,5.93
  Top 0.305: U11.3 16.07,9.13 17.54,7.66 18.15,7.66 18.53,7.28 R8.2 R7.2
N$19
  Top 0.305: R3.2 17.24,15.92 14.98,15.92 | Q3.2 15.73,18.52 14.98,17.76 14.98,15.92 | U13.4 13.87,12.33 14.98,13.44 14.98,15.92
  Top 0.406: Q3.2 17.07,19.14 C6.2
N$20
  Top 0.203: U6.5 55.33,16.57 54.6,17.31 54.6,18.72 54.45,18.87 53.94,18.87 53.69,18.62 U8.2
N$21
  Top 0.406: Q3.1 C6.1 | C6.1 | R4.1 19.3,16.6 18.67,17.24 C6.1
N$22
  Top 0.254: U11.4 13.32,9.13 13.79,8.66 13.79,7.49 14.94,6.34 14.94,4.53 15.5,3.96 17.48,3.96 R1.2
  Top 0.406: Q2.2 C5.2 17.48,3.96
N$23
  Top 0.203: 15.73,0.98 Q2.1 | R2.1 19.51,0.92
  Top 0.406: R2.1 C5.1 17.27,0.88 Q2.1
N$24
  Top 0.203: 19.24,2.78 R2.2
  Top 0.254: U11.1 17.77,7.23 18.49,6.5 18.49,2.98 18.69,2.78 R2.2
N$25  (via drill 0.3)
  Top 0.254: v18.49,12.7 18.49,14.01 18.67,14.19 R4.2 | v16.26,10.97 16.26,10.77 15.92,10.43 U13.1
  Bottom 0.254: v18.49,12.7 17.98,12.7 v16.26,10.97
N$26
  Top 0.406: R3.1 16.17,14.19 15.83,14.53 Q5.3
N$27
  Top 0.406: Q4.3 15.83,5.49 16.28,5.93 R1.1
N$29
  Top 0.406: U13.3 17.17,12.33 R9.2 R10.2
RCLK
  Top 0.203: U1.13 41.28,5.87 41.54,6.12 41.54,8.81 41.23,9.12 39.98,9.12 39.68,9.43 39.68,12.51 40.11,12.94 41.15,12.94 41.35,13.14 41.35,14.18 41.68,14.51 42.59,14.51 43.12,15.04 44.49,15.04 45.07,15.62 U9.4
RX
  Top 0.2: U14.20 24.27,2.93 23.77,2.44 TP2.1
SCL  (via drill 0.3)
  Top 0.2: U14.10 30.33,4.93 30.79,5.38 R11.1 31.35,7.68 31.5,7.82 31.5,9.86 v31.11,10.24 | TP5.1 29.36,13.92 31.07,12.21 31.95,12.21 32.37,11.79 v32.92,11.79 34.12,11.79 U12.7
  Bottom 0.2: v31.11,10.24 31.11,10.79 32.11,11.79 v32.92,11.79
SCL_EXT  (via drill 0.3)
  Top 0.2: v24.93,8.39 25.18,8.39 25.22,8.43 25.66,8.43 26.06,8.03 | v23.57,12.6 23.57,13.06 23.42,13.21 23.42,14.53 ISP1.3 | v7.92,11.07 U16.2
  Top 0.203: 26.06,8.03 26.06,7.19 26.96,6.29 U14.14
  Bottom 0.2: v24.93,8.39 24.49,8.84 23.57,8.84 21.64,10.77 21.64,11.79 22.45,12.6 v23.57,12.6 | v7.92,11.07 7.92,11.27 8.94,12.29 10.86,12.29 12.42,13.84
  Bottom 0.203: 12.42,13.84 21.72,13.84 23.06,15.19 ISP1.3
SCL_EXT_HV
  Top 0.2: J5.4 3.35,17.23 2.34,16.22 2.34,15.38 3.09,14.63 7.32,14.63 7.93,14.02 U16.7
SDA  (via drill 0.3)
  Top 0.2: TP4.1 30.47,17.37 32.92,14.92 v32.92,12.6 33.06,12.46 U12.8 | U14.11 28.46,6.58 v28.64,6.75 28.64,7.53 28.49,7.68 R12.1
  Bottom 0.2: v32.92,12.6 32.31,12.6 30.48,10.77 30.48,10.11 28.64,8.27 v28.64,6.75
SDA_EXT  (via drill 0.3)
  Top 0.2: 23.07,7.62 22.76,7.93 v22.76,8.23 | v8.68,11.07 8.33,11.43 U16.3
  Top 0.203: U14.18 25.02,3.93 23.07,5.88 23.07,7.62
  Bottom 0.2: ISP1.4 24.08,16.7 25.14,15.63 25.14,14.75 24.52,14.12 22.5,14.12 21.86,13.49 20.62,13.49 | v22.76,8.23 20.67,10.31 20.67,13.44 20.62,13.49 | v8.68,11.07 8.68,11.09 9.52,11.93 11.01,11.93 12.56,13.49 20.62,13.49
SDA_EXT_HV
  Top 0.2: U16.6 8.33,14.12 6.66,15.8 J5.3
THERM_SENSE  (via drill 0.35)
  Top 0.203: U14.1 26.46,1.37 26.28,1.18 v25.97,1.18
  Top 0.305: R15.2 RT1.2 32.72,7.38 v32.72,5.69
  Bottom 0.203: v32.72,5.69 30.09,5.69 25.97,1.57 v25.97,1.18
TX
  Top 0.2: TP1.1 24,3.43 U14.19
URES  (via drill 0.3, 0.35)
  Top 0.2: v33.83,6.81 33.83,3.04 31.77,0.97 27.78,0.97 27.46,1.29 U14.3 | v42.06,15.44 42.06,15.85 42.33,16.12 U10.1
  Top 0.203: v44.09,13.19 44.23,13.06 U7.6 | v42.06,15.44 40.64,15.44 TP6.1
  Bottom 0.2: 41.09,11.73 41.09,13.21 | 41.09,13.21 41.09,14.47 v42.06,15.44 | v44.09,13.19 41.11,13.19 41.09,13.21
  Bottom 0.203: v33.83,6.81 34.39,7.37 38.13,7.37 41.09,10.34 41.09,11.73
V_SET1  (via drill 0.3, 0.35)
  Top 0.2: v22.96,5.08 22.39,5.08 C15.1
  Top 0.203: U12.3 29.44,11.16 v29.46,11.18 | 19.44,4.17 R7.1
  Top 0.406: R7.1 C15.1
  Bottom 0.2: 24.18,5.89 23.37,5.08 v22.96,5.08
  Bottom 0.203: v29.46,11.18 24.18,5.89
V_SET2  (via drill 0.3)
  Top 0.2: U12.4 27.17,10.51 v27.03,10.36 | v22.45,11.38 22.45,11.79 22.21,12.03 C12.1
  Top 0.203: U12.4 28.31,10.57
  Top 0.305: C12.1 20.94,12.03 20.13,11.22 18.37,11.22 R9.1
  Bottom 0.2: v27.03,10.36 26.01,11.38 v22.45,11.38
VIN+  (via drill 0.3)
  Top 0.2: 5.49,12.8 5.53,12.85 U16.8
  Top 0.254: 7.73,8.99 C14.1
  Top 0.305: C1.1 5.44,8.37
  Top 0.406: C11.1 7.78,7.72 C14.1 | J1.P2 8.88,3.37 Q1.1 | J5.2 5.03,13.26 5.49,12.8 5.49,8.42 5.44,8.37 5.47,8.33 6.1,8.33 6.91,7.52 C11.1 | v7.72,6.3 7.72,7.38 C11.1 | C1.1 5.34,8.47 U$1.4
  Bottom 0.406: J1.P2 7.72,4.52 v7.72,6.3 | J2.P2 10.26,17.83 7.52,17.83 3.35,13.66 J5.2
VIN-  (via drill 0.3)
  Top 0.406: v5.49,4.06 5.23,4.32 Q1.3
  Bottom 0.406: J5.1 3.35,6.2 v5.49,4.06
VREF
  Top 0.254: RT1.1 31.9,8.27 31.9,4.05 31.13,3.28 30.65,3.28 30.5,3.43 U14.7
  Top 0.305: RT1.1 32.82,10.77 31.78,11.81 U12.2 27.51,11.81 27.23,12.09 26.66,12.09
  Top 0.406: R14.1 26.66,12.09 26.66,11.46 D1.1

### Text on the board
bDocu: ALT | SDA | JP0 | GND | Fin1 | 3V3 | SCL | LED2- | DEFAULT | V+ | V+ | ± | V- | 3.3v ~ 5v | Project Calypso v0.1.0 / 2019.02.04 / Bobby Schulz (schematic) / Andy Wickert and Bobby Schulz (layout) / UMN senior design team (basis design) / / Design: Northern Widget LLC / in collaboration with / The University of Minnesota | V+ | LED1- | 3V3 | Fin0 | GND | Turbidity sensor: / Light and detector control board